# Altium schematic sheet РЕУН.468323.001_LED_DRV_ISO_2.SchDoc: =Name-1str
size 594 x 420 mm; SheetNumber: 7; Вид изделия: Документация; Раздел: Документация; Код документа: Э3; Вид документа: Схема электрическая принципиальная; Класс документа: Конструкторский документ; Создавать изделие в PLM: Yes; DocumentCode: РЕУН.468323.001 Э3 2D; DocumentView: Схема электрическая принципиальная; DocumentClass: Конструкторский документ; ProductView: Документация; Format: А2
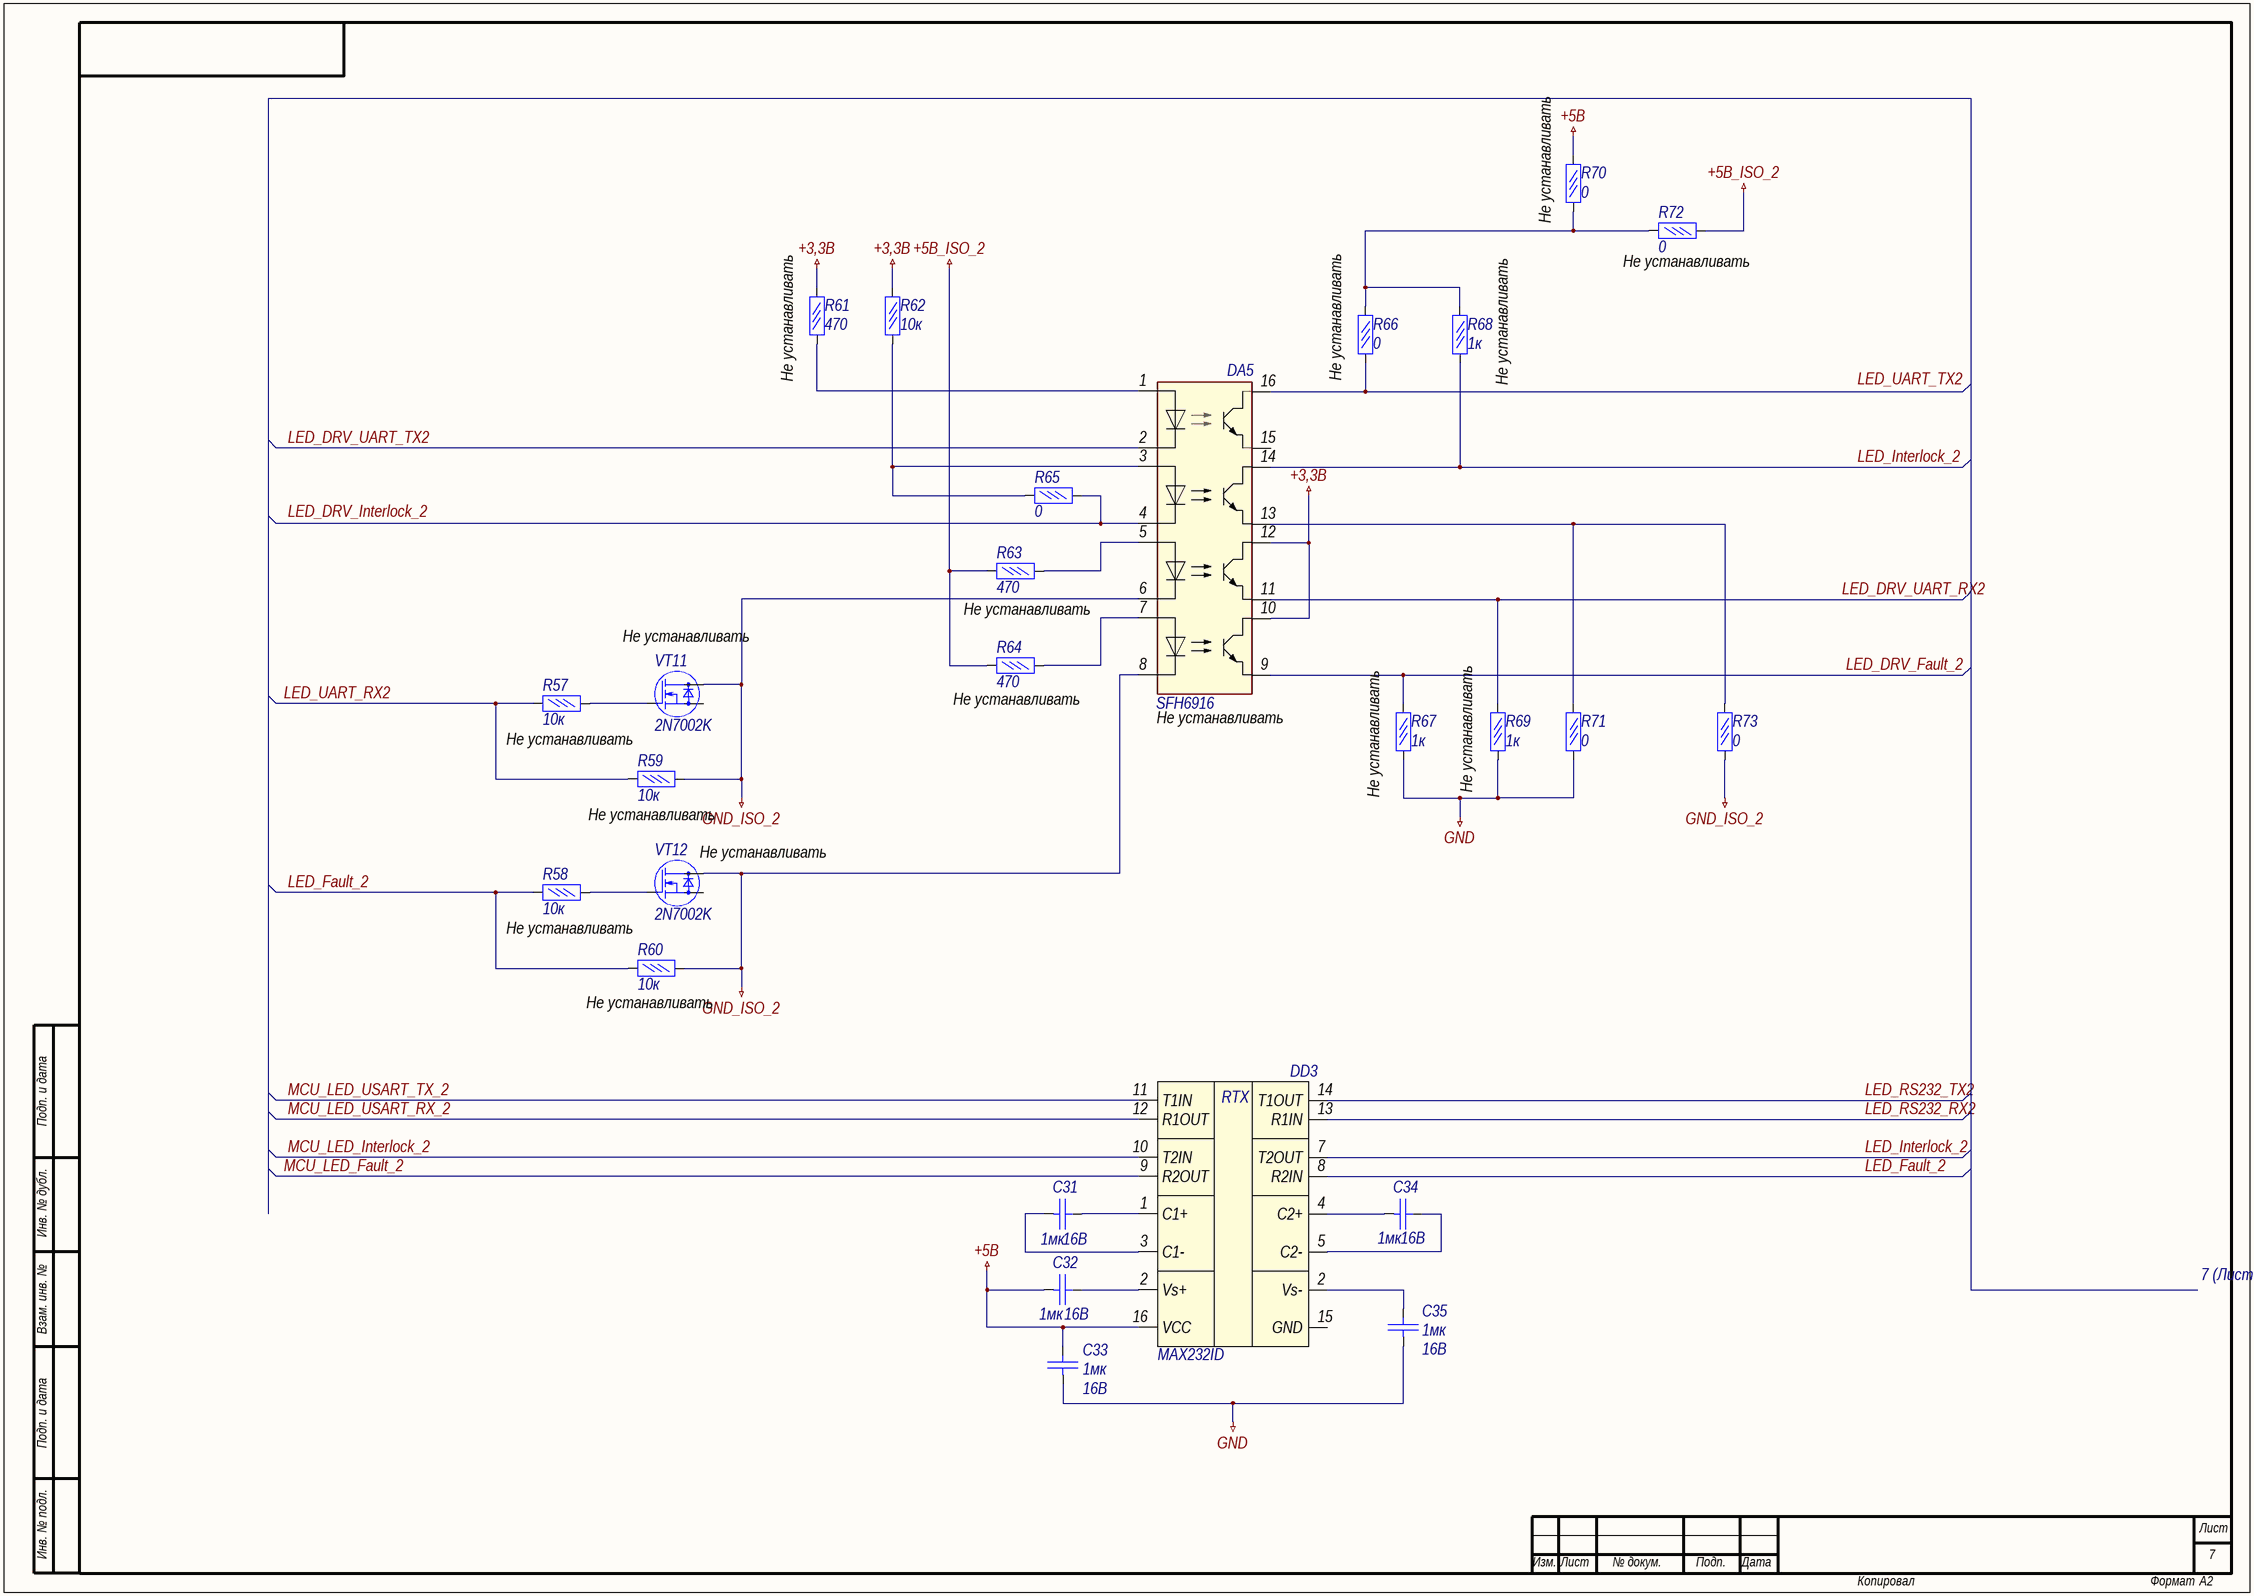
[diagram p0: РЕУН.468323.001_LED_DRV_ISO_2.SchDoc]

## Parts
C31  Voltage: 16В  [C0805_AA]  (hidden comment: 1мк)
C32  Voltage: 16В  [C0805_AA]  (hidden comment: 1мк)
C33  Voltage: 16В  [C0805_AA]  (hidden comment: 1мк)
C34  Voltage: 16В  [C0805_AA]  (hidden comment: 1мк)
C35  Voltage: 16В  [C0805_AA]  (hidden comment: 1мк)
DA5  SFH6916
DD3  MAX232ID
R57  10к  [R1206]
R58  10к  [R1206]
R59  10к  [R1206]
R60  10к  [R1206]
R61  470  [R1206]
R62  10к  [R1206]
R63  470  [R1206]
R64  470  [R1206]
R65  0  [R1206]
R66  0  [R1206]
R67  1к  [R1206]
R68  1к  [R1206]
R69  1к  [R1206]
R70  0  [R1206]
R71  0  [R1206]
R72  0  [R1206]
R73  0  [R1206]
VT11  2N7002K  [SOT23-3]
VT12  2N7002K  [SOT23-3]

## Nets
+3,3В: DA5.10 DA5.12 R61.1 R62.2
+5В: C32.2 C33.1 DD3.16(VCC) R70.1
+5В_ISO_2: R63.1 R64.1 R72.1
GND: C33.2 C35.2 R67.1 R69.1 R71.1
GND_ISO_2: DA5.6 DA5.8 R59.2 R60.2 R73.1 VT11.3(D) VT12.3(D)
LED_DRV_Fault_2: DA5.9 R67.2
LED_DRV_UART_RX2: DA5.11 R69.2
LED_DRV_UART_TX2: DA5.2
LED_Fault_2: DD3.8(R2IN) R58.1 R60.1
LED_Interlock_2: DA5.14 DD3.7(T2OUT) R68.1
LED_RS232_RX2: DD3.13(R1IN)
LED_RS232_TX2: DD3.14(T1OUT)
LED_UART_RX2: R57.1 R59.1
MCU_LED_Fault_2: DD3.9(R2OUT)
MCU_LED_Interlock_2: DD3.10(T2IN)
MCU_LED_USART_RX_2: DD3.12(R1OUT)
MCU_LED_USART_TX_2: DD3.11(T1IN)
NetC31_1: C31.1 DD3.1(C1+)
NetC31_2: C31.2 DD3.3(C1-)
NetC32_1: C32.1 DD3.2(Vs+)
NetC34_1: C34.1 DD3.5(C2-)
NetC34_2: C34.2 DD3.4(C2+)
NetC35_1: C35.1 DD3.2(Vs-)
NetDA5_1: DA5.1 R61.2
NetDA5_3: DA5.3 R62.1 R65.1
NetDA5_4: DA5.4 R65.2
NetDA5_5: DA5.5 R63.2
NetDA5_7: DA5.7 R64.2
NetDA5_13: DA5.13 R71.2 R73.2
NetDA5_16: DA5.16 R66.1
NetR57_2: R57.2 VT11.1(G)
NetR58_2: R58.2 VT12.1(G)
NetR66_2: R66.2 R68.2 R70.2 R72.2

Not connected (* = marked no-connect by the designer): DA5 15; DD3 15(GND); VT11 2(S); VT12 2(S)

## Notes on the sheet
- (near R70) Не устанавливать
- (near R72) Не устанавливать
- (near R61) Не устанавливать
- (near R66) Не устанавливать
- (near R68) Не устанавливать
- (near VT11) Не устанавливать
- Не устанавливать
- (near R64) Не устанавливать
- (near DA5) Не устанавливать
- (near R67) Не устанавливать
- (near R69) Не устанавливать
- (near R59) Не устанавливать
- (near VT12) Не устанавливать
- (near R60) Не устанавливать
- 7 (Лист 1, 3, 4, 5, 6, 8, 9, 10, 11, 12)
- Labels drawn without touching a wire or pin: LED_DRV_Interlock_2, LED_UART_TX2
- Подп. и дата
- Инв. № дубл.
- Взам. инв. №
- Инв. № подл.
- Лист
- Изм.
- № докум.
- Подп.
- Дата
- Копировал
- Формат
- (in symbol MAX232ID) RTX

## Library data of the parts
C31-C35 = Конденсатор кер.: Name: CC0603KRX7R7BB105; Value: 1мк
DA5 = OPTO-4: Опторазвязка х4
DD3 = MAX232ID: Dual EIA-232 Drivers/Receivers
R57-R73 = Резистор  0,05Вт: Резистор 0,05Вт; Power rating: 0,05Вт
  R57-R60 R62: Value: 10к
  R61 R63 R64: Value: 470
  R65 R66 R70-R73: Value: 0
  R67-R69: Value: 1к
VT11 VT12 = mosfet-n: Name: 2N7002K